# EAGLE schematic TINRS - SmallStuff (EAGLE 7.7.0)
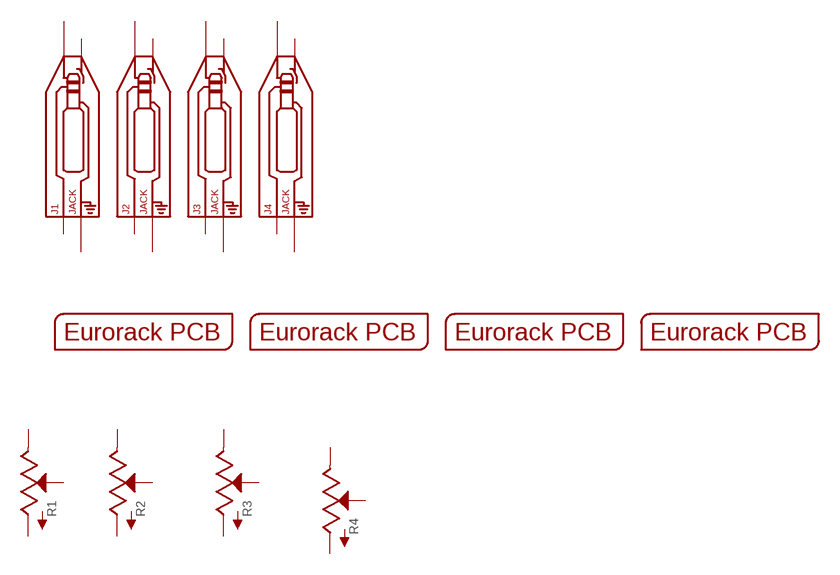
[diagram p0: schematic, sheet 1]

## Parts
J1  JACK  AUDIO-JACK_SMALLSYMBOLNODRILL  [3.5MM-JACK-SWITCH-13MM-NOHOLES]
J2  JACK  AUDIO-JACK_SMALLSYMBOLNODRILL  [3.5MM-JACK-SWITCH-13MM-NOHOLES]
J3  JACK  AUDIO-JACK_SMALLSYMBOLNODRILL  [3.5MM-JACK-SWITCH-13MM-NOHOLES]
J4  JACK  AUDIO-JACK_SMALLSYMBOLNODRILL  [3.5MM-JACK-SWITCH-13MM-NOHOLES]
PCB1  EURORACK_PCB4HP  [EURORACK4HPPCB]
PCB2  EURORACK_PCB4HP  [EURORACK4HPPCB]
PCB3  EURORACK_PCB4HP  [EURORACK4HPPCB]
PCB4  EURORACK_PCB4HP  [EURORACK4HPPCB]
R1  POTSQUAREHOLE_SMALLKNOB  [ALPS_POT_SQUAREHOLES]
R2  POTSQUAREHOLE_SMALLKNOB  [ALPS_POT_SQUAREHOLES]
R3  POTSQUAREHOLE_SMALLKNOB  [ALPS_POT_SQUAREHOLES]
R4  POTSQUAREHOLE_SMALLKNOB  [ALPS_POT_SQUAREHOLES]
Unconnected: J1.RING_B@1(RING) J1.RING_T@3(RING) J1.SECOND_B@1(SECOND) J1.SECOND_T@3(SECOND) J1.SWITCH_B@1(SWITCH) J1.SWITCH_T@3(SWITCH) J1.TIP_B@1(TIP) J1.TIP_T@3(TIP) J2.RING_B@1(RING) J2.RING_T@3(RING) J2.SECOND_B@1(SECOND) J2.SECOND_T@3(SECOND) J2.SWITCH_B@1(SWITCH) J2.SWITCH_T@3(SWITCH) J2.TIP_B@1(TIP) J2.TIP_T@3(TIP) J3.RING_B@1(RING) J3.RING_T@3(RING) J3.SECOND_B@1(SECOND) J3.SECOND_T@3(SECOND) J3.SWITCH_B@1(SWITCH) J3.SWITCH_T@3(SWITCH) J3.TIP_B@1(TIP) J3.TIP_T@3(TIP) J4.RING_B@1(RING) J4.RING_T@3(RING) J4.SECOND_B@1(SECOND) J4.SECOND_T@3(SECOND) J4.SWITCH_B@1(SWITCH) J4.SWITCH_T@3(SWITCH) J4.TIP_B@1(TIP) J4.TIP_T@3(TIP) R1.P$1(E) R1.P$2(S) R1.P$3(A) R2.P$1(E) R2.P$2(S) R2.P$3(A) R3.P$1(E) R3.P$2(S) R3.P$3(A) R4.P$1(E) R4.P$2(S) R4.P$3(A)

## Library data of the parts
J1-J4 = EurorackModularParts:AUDIO-JACK_SMALLSYMBOL: Switching Mono 3.5mm Audio Jack from Erthenvar.
PCB1-PCB4 = EurorackModularParts:EURORACK_PCB
R1-R4 = EurorackModularParts:POT